# EAGLE design nrf24_fab (EAGLE 6.3)
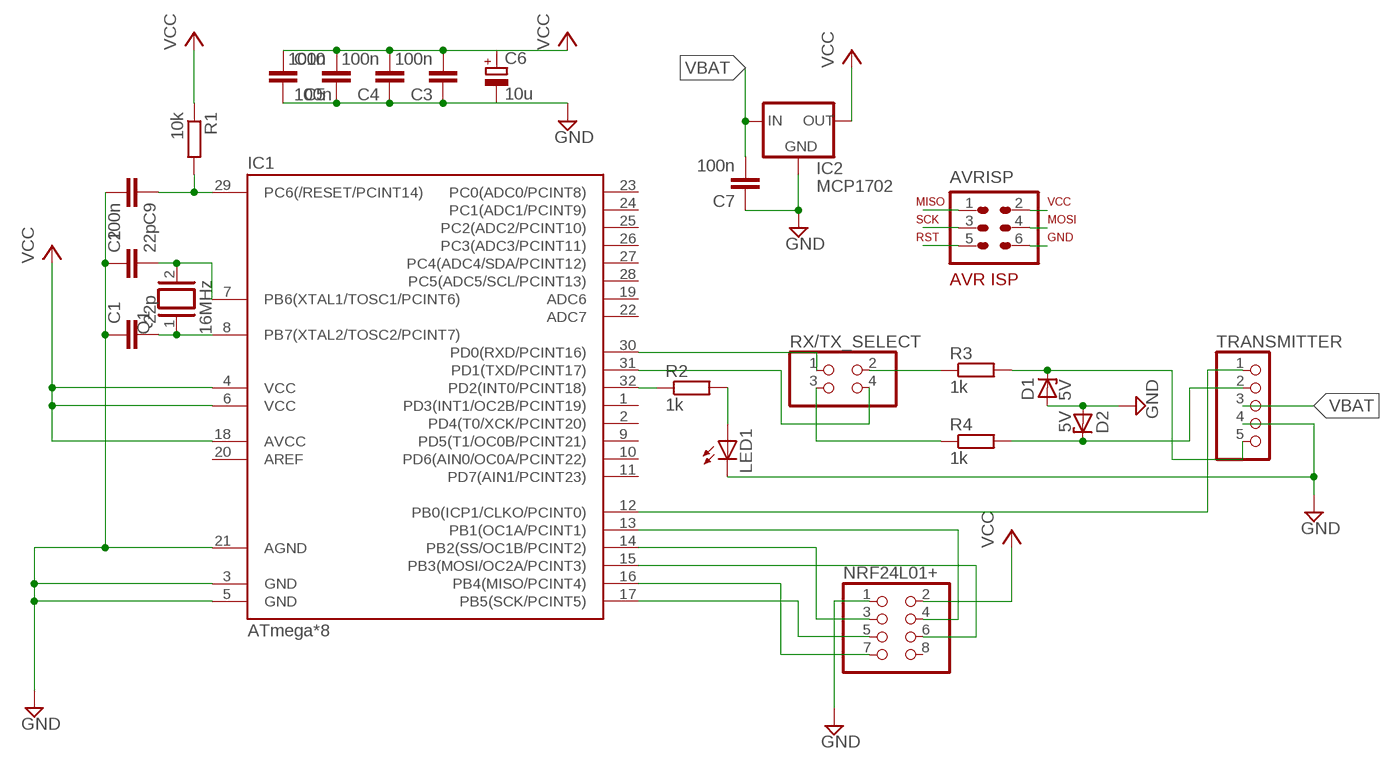
[diagram p0: schematic, sheet 1]

## Parts
AVRISP  AVR-ISP-6VERT  [AVR-ISP-6]
C1  22p  C-EUC0805  [C0805]
C2  22p  C-EUC0805  [C0805]
C3  100n  C-EUC0805  [C0805]
C4  100n  C-EUC0805  [C0805]
C5  100n  C-EUC0805  [C0805]
C6  10u  CPOL-EUE2.5-6  [E2,5-6]
C7  100n  C-EUC0805  [C0805]
C9  100n  C-EUC0805  [C0805]
C10  100n  C-EUC0805  [C0805]
D1  5V  ZENER-DIODESOD80C  [SOD80C]
D2  5V  ZENER-DIODESOD80C  [SOD80C]
IC1  ATmega*8  MEGA48/88/168-AU  [TQFP32-08]
IC2  MCP1702  [TO-92]
LED1  LEDSMT1206  [1206]
NRF24L01+  PINHD-2X4  [2X04]
Q1  16MHz  XTAL/S  [QS]
R1  10k  R-EU_M0805  [M0805]
R2  1k  R-EU_M0805  [M0805]
R3  1k  R-EU_M0805  [M0805]
R4  1k  R-EU_M0805  [M0805]
RX/TX_SELECT  PINHD-2X2  [2X02]
TRANSMITTER  PINHD-1X5  [1X05]

## Nets
AVR_RXD: IC1.30(PD0(RXD/PCINT16)) RX/TX_SELECT.1
AVR_TXD: IC1.31(PD1(TXD/PCINT17)) RX/TX_SELECT.4
CE: IC1.14(PB2(SS/OC1B/PCINT2)) NRF24L01+.3
CSN: IC1.13(PB1(OC1A/PCINT1)) NRF24L01+.4
GND: AVRISP.6 C1.1 C2.1 C3.1 C4.1 C5.1 C6.- C7.1 C9.2 C10.2 D1.A D2.A IC1.3(GND) IC1.5(GND) IC1.21(AGND) IC2.1(GND) LED1.C NRF24L01+.1 TRANSMITTER.4
LED: LED1.A R2.2
MISO: AVRISP.1 IC1.16(PB4(MISO/PCINT4)) NRF24L01+.7
MOSI: AVRISP.4 IC1.15(PB3(MOSI/OC2A/PCINT3)) NRF24L01+.6
N$1: D2.C R4.2 TRANSMITTER.2
N$3: R4.1 RX/TX_SELECT.3
N$4: R3.1 RX/TX_SELECT.2
N$5: D1.C R3.2 TRANSMITTER.5
N$6: C1.2 IC1.8(PB7(XTAL2/TOSC2/PCINT7)) Q1.1
N$7: C2.2 IC1.7(PB6(XTAL1/TOSC1/PCINT6)) Q1.2
PD2: IC1.32(PD2(INT0/PCINT18)) R2.1
PPM: IC1.12(PB0(ICP1/CLKO/PCINT0)) TRANSMITTER.1
RST: AVRISP.5 C9.1 IC1.29(PC6(/RESET/PCINT14)) R1.2
SCK: AVRISP.3 IC1.17(PB5(SCK/PCINT5)) NRF24L01+.5
VBAT: C7.2 IC2.2(IN) TRANSMITTER.3
VCC: AVRISP.2 C3.2 C4.2 C5.2 C6.+ C10.1 IC1.4(VCC) IC1.6(VCC) IC1.18(AVCC) IC2.3(OUT) NRF24L01+.2 R1.1
Unconnected: IC1.1(PD3(INT1/OC2B/PCINT19)) IC1.2(PD4(T0/XCK/PCINT20)) IC1.9(PD5(T1/OC0B/PCINT21)) IC1.10(PD6(AIN0/OC0A/PCINT22)) IC1.11(PD7(AIN1/PCINT23)) IC1.19(ADC6) IC1.20(AREF) IC1.22(ADC7) IC1.23(PC0(ADC0/PCINT8)) IC1.24(PC1(ADC1/PCINT9)) IC1.25(PC2(ADC2/PCINT10)) IC1.26(PC3(ADC3/PCINT11)) IC1.27(PC4(ADC4/SDA/PCINT12)) IC1.28(PC5(ADC5/SCL/PCINT13)) NRF24L01+.8

## Library data of the parts
AVRISP = avr-7:AVR-ISP-6: AVR ISP-6 Serial Programming Header
C1-C5 C7 C9 C10 = rcl:C-EU: CAPACITOR, European symbol
C6 = rcl:CPOL-EU: POLARIZED CAPACITOR, European symbol
D1 D2 = diode:ZENER-DIODE: Z-Diode
IC1 = avr-7:MEGA48/88/168
IC2 = Alis custom parts:MCP1702
LED1 = led:LED: LED OSRAM: - CHIPLED LG R971, LG N971, LY N971, LG Q971, LY Q971, LO R971, LY R971 LH N974, LH R974 LS Q976, LO Q976, LY Q976 LO Q996 - Hyper CHIPLED LW Q18S LB Q993, LB Q99A, LB R99A - SideLED LS A670, LO A670, LY A670, LG A670, LP A670 LB A673, LV A673, LT A673, LW A673 LH A674 LY A675 LS A676, LA A676, LO A676, LY A676, LW A676 LS A679, LY A679, LG A679 - Hyper Micro SIDELED® LS Y876, LA Y876, LO Y876, LY Y876 LT Y87S - SmartLED LW L88C, LW L88S LB L89C, LB L89S, LG L890 LS L89K, LO L89K, LY L89K LS L896, LA L896, LO L896, LY L896 - TOPLED LS T670, LO T670, LY T670, LG T670, LP T670 LSG T670, LSP T670, LSY T670, LOP T670, LYG T670 LG T671, LOG T671, LSG T671 LB T673, LV T673, LT T673, LW T673 LH T674 LS T676, LA T676, LO T676, LY T676, LB T676, LH T676, LSB T676, LW T676 LB T67C, LV T67C, LT T67C, LS T67K, LO T67K, LY T67K, LW E67C LS E67B, LA E67B, LO E67B, LY E67B, LB E67C, LV E67C, LT E67C LW T67C LS T679, LY T679, LG T679 LS T770, LO T770, LY T770, LG T770, LP T770 LB T773, LV T773, LT T773, LW T773 LH T774 LS E675, LA E675, LY E675, LS T675 LS T776, LA T776, LO T776, LY T776, LB T776 LHGB T686 LT T68C, LB T68C - Hyper Mini TOPLED® LB M676 - Mini TOPLED Santana® LG M470 LS M47K, LO M47K, LY M47K Source: http://www.osram.convergy.de LUXEON: - LUMILED® LXK2-PW12-R00, LXK2-PW12-S00, LXK2-PW14-U00, LXK2-PW14-V00 LXK2-PM12-R00, LXK2-PM12-S00, LXK2-PM14-U00 LXK2-PE12-Q00, LXK2-PE12-R00, LXK2-PE12-S00, LXK2-PE14-T00, LXK2-PE14-U00 LXK2-PB12-K00, LXK2-PB12-L00, LXK2-PB12-M00, LXK2-PB14-N00, LXK2-PB14-P00, LXK2-PB14-Q00 LXK2-PR12-L00, LXK2-PR12-M00, LXK2-PR14-Q00, LXK2-PR14-R00 LXK2-PD12-Q00, LXK2-PD12-R00, LXK2-PD12-S00 LXK2-PH12-R00, LXK2-PH12-S00 LXK2-PL12-P00, LXK2-PL12-Q00, LXK2-PL12-R00 Source: www.luxeon.com KINGBRIGHT: KA-3528ASYC Source: www.kingbright.com
NRF24L01+ = pinhead:PINHD-2X4: PIN HEADER
Q1 = special:XTAL/S: CRYSTAL
R1-R4 = rcl:R-EU_: RESISTOR, European symbol
RX/TX_SELECT = pinhead:PINHD-2X2: PIN HEADER
TRANSMITTER = pinhead:PINHD-1X5: PIN HEADER

## Board
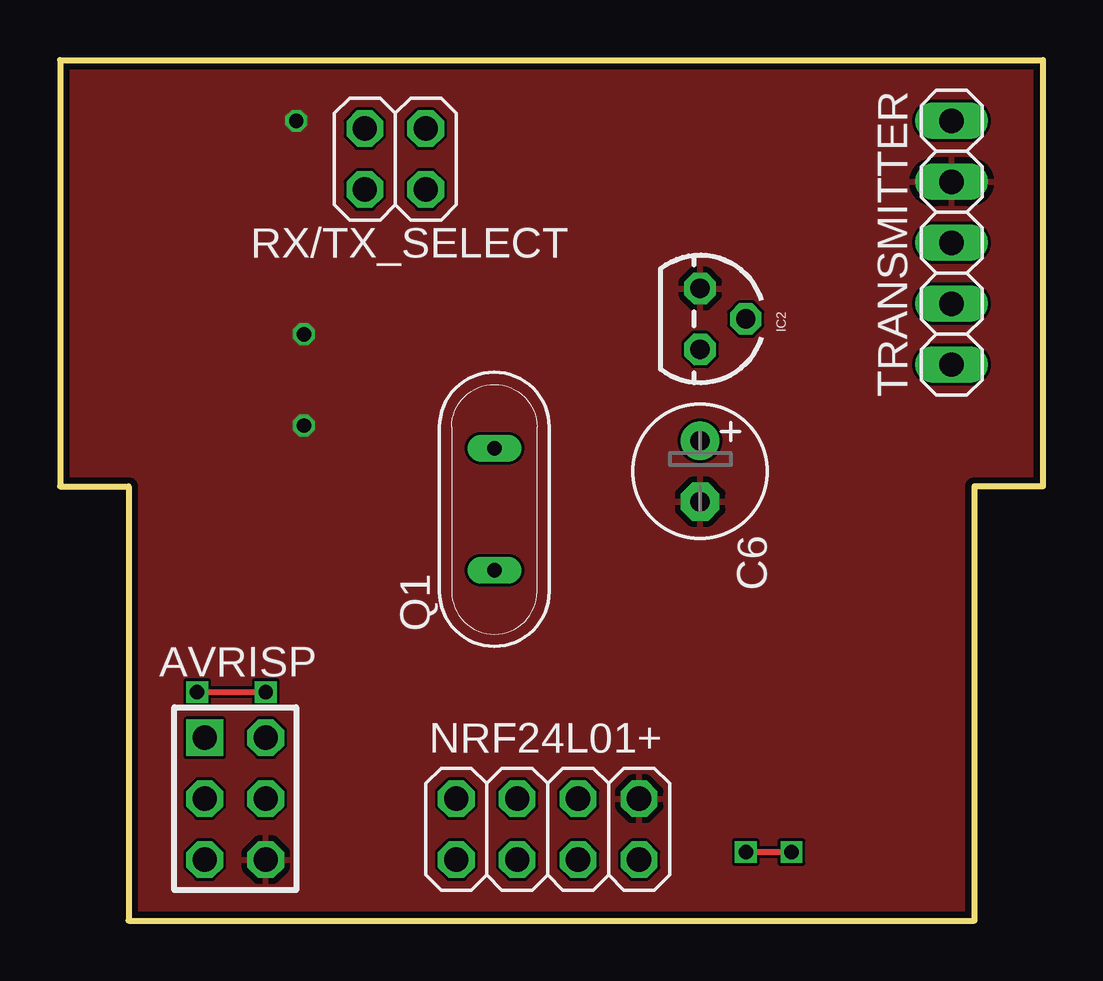
[diagram p1: board, top side]
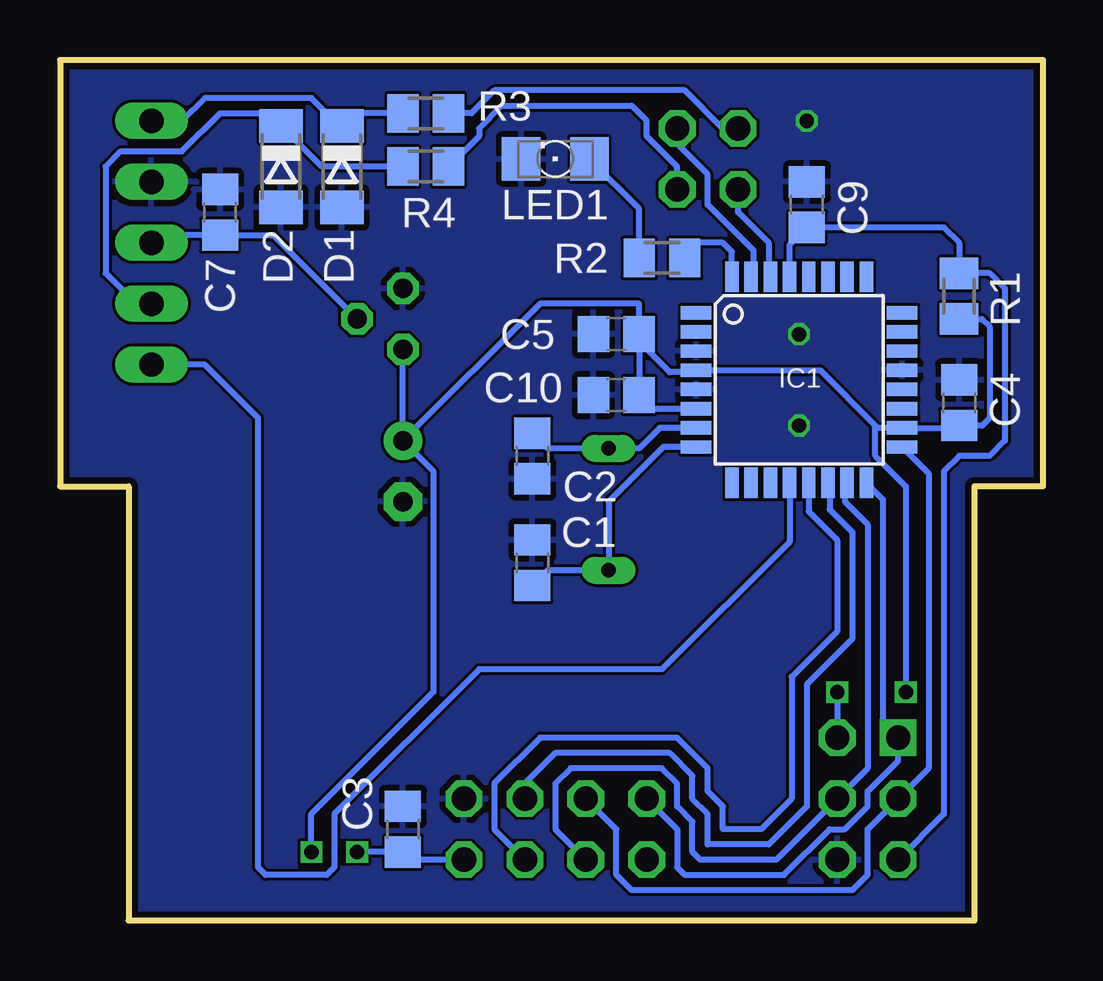
[diagram p2: board, bottom side, seen from below]

Size 40.96 x 35.88 mm. Coordinates in mm from the lower left corner, seen from the top.
Outline: 0,35.87 0,18.1
Outline: 0,18.1 0,35.88 40.96,35.88 40.96,18.1 38.1,18.1 38.1,0 2.86,0 2.86,18.1 0,18.1
Copper layers (1*16): Top 0.035mm / dielectric 1.5mm / Bottom 0.035mm
Design rules "dirt_cheap_dirty_boards.v1": minimum track width 5mil, minimum drill 12mil, track to track 5mil, track to pad 5mil, pad to pad 5mil, via to via 5mil, smd to smd 0mil, copper to edge 10mil, drill to drill 10mil, minimum pad ring 10mil, minimum via ring 6mil, stop-mask expansion 2mil, vias tented up to drill 25mil, thermal gap 10mil

### Footprints (pad centres in the part's own frame; a part is rotated, then mirrored left to right if it is on the bottom)
AVR-ISP-6 = drill 1.016 square: 1 -2.54,-1.27 | drill 1.016 octagon: 2 -2.54,1.27; 3 0,-1.27; 4 0,1.27; 5 2.54,-1.27; 6 2.54,1.27
C0805 = smd 1.3 x 1.5: 1 -0.95,0; 2 0.95,0
E2,5-6 = drill 0.813 pad 1.6: + -1.27,0 | drill 0.813 pad 1.6 octagon: - 1.27,0
SOD80C = smd 1.4 x 1.8: A 1.7,0; C -1.7,0
TQFP32-08 = smd 1.27 x 0.559: 1 -4.293,2.8; 2 -4.293,2; 3 -4.293,1.2; 4 -4.293,0.4; 5 -4.293,-0.4; 6 -4.293,-1.2; 7 -4.293,-2; 8 -4.293,-2.8; 17 4.293,-2.8; 18 4.293,-2; 19 4.293,-1.2; 20 4.293,-0.4; 21 4.293,0.4; 22 4.293,1.2; 23 4.293,2; 24 4.293,2.8 | smd 0.559 x 1.27: 9 -2.8,-4.293; 10 -2,-4.293; 11 -1.2,-4.293; 12 -0.4,-4.293; 13 0.4,-4.293; 14 1.2,-4.293; 15 2,-4.293; 16 2.8,-4.293; 25 2.8,4.293; 26 2,4.293; 27 1.2,4.293; 28 0.4,4.293; 29 -0.4,4.293; 30 -1.2,4.293; 31 -2,4.293; 32 -2.8,4.293
TO-92 = drill 0.8 pad 1.27 octagon: 1 -1.27,0; 2 0,1.905; 3 1.27,0
1206 = smd 1.6 x 1.803: A -1.422,0; C 1.422,0
2X04 = drill 1.016 octagon: 1 -3.81,-1.27; 2 -3.81,1.27; 3 -1.27,-1.27; 4 -1.27,1.27; 5 1.27,-1.27; 6 1.27,1.27; 7 3.81,-1.27; 8 3.81,1.27
QS = drill 0.61 long: 1 -2.54,0; 2 2.54,0
M0805 = smd 1.3 x 1.6: 1 -0.95,0; 2 0.95,0
2X02 = drill 1.016 octagon: 1 -1.27,-1.27; 2 -1.27,1.27; 3 1.27,-1.27; 4 1.27,1.27
1X05 = drill 1.016 long: 1 -5.08,0; 2 -2.54,0; 3 0,0; 4 2.54,0; 5 5.08,0

### Placement (x,y rotation side)
AVRISP  7.3,5.08 270 top
C1  21.27,14.92 270 bottom
C2  21.27,19.37 90 bottom
C3  26.67,3.81 270 bottom
C4  3.49,21.59 270 bottom
C5  17.78,24.45 0 bottom
C6  26.67,18.73 270 top
C7  34.29,29.53 270 bottom
C9  9.84,29.84 90 bottom
C10  17.78,21.91 180 bottom
D1  29.21,31.43 270 bottom
D2  31.75,31.43 270 bottom
IC1  10.16,22.54 0 bottom
IC2  26.67,25.08 270 top
LED1  20.32,31.75 180 bottom
NRF24L01+  20.32,3.81 180 top
Q1  18.1,17.14 90 top
R1  3.49,26.04 90 bottom
R2  15.88,27.62 180 bottom
R3  25.72,33.66 180 bottom
R4  25.72,31.43 180 bottom
RX/TX_SELECT  13.97,31.75 0 top
TRANSMITTER  37.15,28.26 90 top

### Tracks (layer width: path | path; a pad name or v marks a point on that pad's centre or on a via)
AVR_RXD
  Bottom 0.254: RX/TX_SELECT.1 12.7,29.53 11.43,28.26 11.43,26.91 IC1.30
AVR_TXD
  Bottom 0.254: IC1.31 12.06,26.93 12.06,27.94 13.97,29.84 13.97,31.11 15.24,32.38 RX/TX_SELECT.4
CE
  Bottom 0.254: IC1.14 8.89,18.18 8.89,17.14 7.94,16.19 7.94,11.75 9.84,9.84 9.84,4.76 11.43,3.17 13.97,3.17 13.97,4.45 14.61,5.08 14.61,6.03 15.56,6.99 20.32,6.99 21.59,5.71 NRF24L01+.3
CSN
  Bottom 0.254: IC1.13 9.76,17.06 8.57,15.88 8.57,12.06 10.48,10.16 10.48,5.08 11.75,3.81 13.34,3.81 13.34,4.76 13.97,5.4 13.97,6.35 15.24,7.62 20.95,7.62 22.86,5.71 22.86,3.81 NRF24L01+.4
GND  (via drill 0.6)
  other vias: 9.84,33.34 10.16,24.45 10.16,20.64
  pour Bottom: -0.95,36.83 -0.95,17.14 1.91,17.14 1.91,-0.64 39.05,-0.64 39.05,17.14 41.91,17.14 41.91,36.83
  pour Top: -0.95,36.83 -0.95,17.14 1.91,17.14 1.91,-0.64 39.05,-0.64 39.05,17.14 41.91,17.14 41.91,36.83
LED
  Bottom 0.254: R2.2 16.82,29.68 LED1.A
MISO
  Bottom 0.254: IC1.16 6.67,17.56 6.67,8.26 AVRISP.1 6.03,6.67 7.3,5.4 7.3,4.76 8.26,3.81 8.89,3.81 10.79,1.91 14.92,1.91 15.24,2.22 15.24,3.81 NRF24L01+.7
MOSI
  Bottom 0.254: IC1.15 8.26,18.16 8.26,17.46 7.3,16.51 7.3,6.35 AVRISP.4 11.11,2.54 14.29,2.54 14.61,2.86 14.61,4.13 15.24,4.76 15.24,5.71 15.88,6.35 19.68,6.35 20.32,5.71 20.32,3.81 NRF24L01+.6
N$1
  Bottom 0.254: TRANSMITTER.2 37.78,25.72 39.05,26.99 39.05,31.43 38.42,32.07 35.88,32.07 34.29,33.66 32.27,33.66 D2.C 30.05,31.43 R4.2
N$3
  Bottom 0.254: RX/TX_SELECT.3 15.24,31.43 16.51,32.7 16.51,33.34 17.14,33.97 22.54,33.97 23.5,33.02 23.5,32.7 R4.1
N$4
  Bottom 0.254: RX/TX_SELECT.2 13.34,33.02 14.92,34.61 22.86,34.61 23.81,33.66 R3.1
N$5
  Bottom 0.254: TRANSMITTER.5 35.88,33.34 34.92,34.29 30.48,34.29 29.32,33.13 D1.C 28.69,33.66 R3.2
N$6
  Bottom 0.254: IC1.8 15.82,19.74 18.1,17.46 Q1.1 20.64,14.61 C1.2
N$7
  Bottom 0.254: C2.2 20.64,19.68 Q1.2 16.83,19.68 15.97,20.54 IC1.7
PD2
  Bottom 0.254: IC1.32 12.96,27.88 13.34,28.26 14.61,28.26 14.61,27.94 R2.1
PPM
  Bottom 0.254: IC1.12 10.56,15.79 15.88,10.48 23.5,10.48 29.53,4.45 29.53,2.22 29.84,1.91 32.38,1.91 32.7,2.22 32.7,20.95 34.92,23.18 TRANSMITTER.1
RST
  Bottom 0.254: AVRISP.5 4.13,4.45 4.13,18.73 3.49,19.37 2.22,19.37 1.59,20 1.59,26.35 2.22,26.99 R1.2 3.49,28.26 4.13,28.89 C9.1 10.56,28.18 IC1.29
SCK
  Bottom 0.254: IC1.17 4.76,18.64 4.76,6.35 AVRISP.3 7.3,3.81 7.3,1.91 7.94,1.27 17.14,1.27 17.78,1.91 17.78,3.81 NRF24L01+.5
VBAT
  Bottom 0.254: TRANSMITTER.3 36.83,28.58 C7.2 32.07,28.58 IC2.2
VCC  (via drill 0.6)
  Top 0.254: v28.57,2.86 v30.48,2.86 | v5.71,9.53 v8.57,9.53
  Bottom 0.254: NRF24L01+.2 26.67,2.54 C3.2 v28.57,2.86 | 6.99,20.54 IC1.18 3.59,20.54 C4.2 2.54,20.64 2.22,20.95 2.22,24.77 2.54,25.09 R1.1 | 14.38,21.27 IC1.6 16.27,21.34 C10.1 16.83,24.13 | C5.2 16.83,25.08 C5.2 | C6.+ IC2.3 | C5.2 16.83,25.71 16.83,25.72 20.95,25.72 C6.+ | 16.83,24.13 15.56,22.86 14.54,22.86 IC1.4 9.29,22.94 6.99,20.64 6.99,20.54 | 16.83,24.13 C5.2 | C5.2 | v30.48,2.86 30.48,4.45 25.4,9.53 25.4,18.73 C6.+ | v5.71,9.53 5.71,18.1 6.99,19.37 6.99,20.54 | v8.57,9.53 AVRISP.2